# Altium schematic sheet AlcoholDetectie_V2.SchDoc
size A4; SheetNumber: 1; SheetTotal: 1
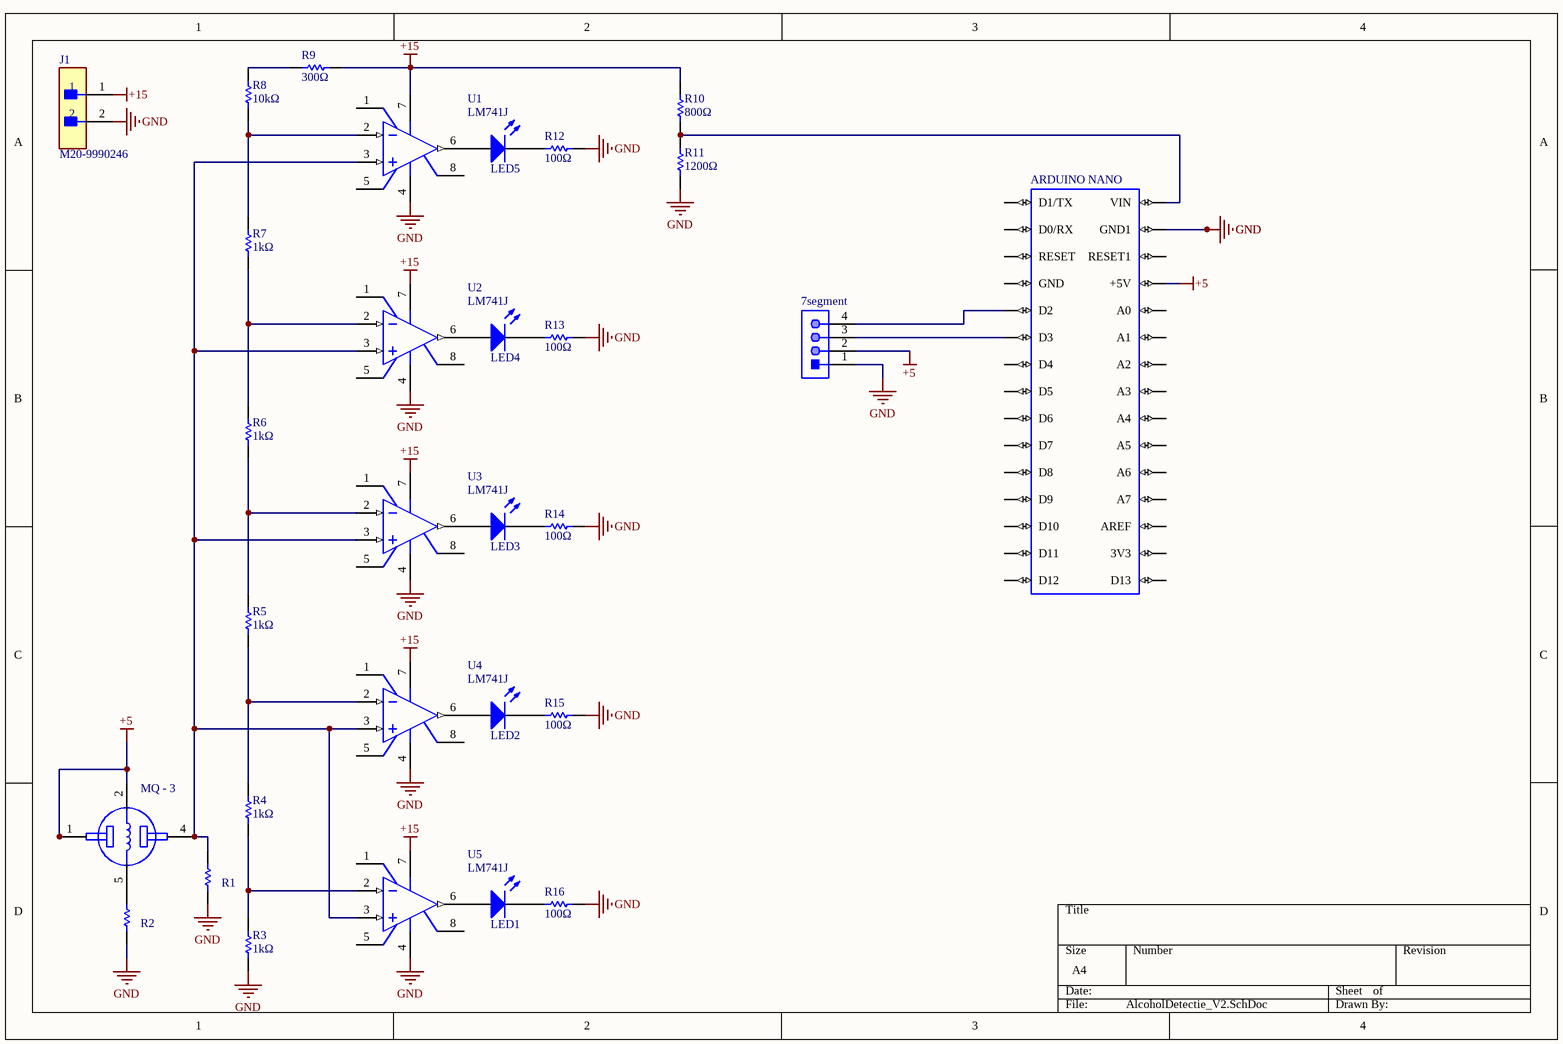
[diagram p0: AlcoholDetectie_V2.SchDoc]

## Parts
7segment  61300411121  [61300411121]  (value not drawn)
ARDUINO_NANO  ARDUINONANO  [PDIP-32]  (value not drawn)
GROEN  LED1  [LED-1]
J1  M20-9990246  [FP-M20-9990246-MFG]
MQ_-_3  SEN-08880  [XDCR_SEN-08880]  (value not drawn)
ORANJE_1  LED2  [LED-1]
ORANJE_2  LED3  [LED-1]
R1  1k Ω  [RESC2013X50X30LL20T20]  (value not drawn)
R2  5,1 Ω  [RESC2013X50X30LL20T20]  (value not drawn)
R3  1kΩ  [RESC2013X50X30LL20T20]
R4  1kΩ  [RESC2013X50X30LL20T20]
R5  1kΩ  [RESC2013X50X30LL20T20]
R6  1kΩ  [RESC2013X50X30LL20T20]
R7  1kΩ  [RESC2013X50X30LL20T20]
R8  10kΩ  [RESC2013X50X30LL20T20]
R9  300Ω  [RESC2013X50X30LL20T20]
R10  800Ω  [RESC2013X50X30LL20T20]
R11  1200Ω  [RESC2013X50X30LL20T20]
R12  100Ω  [RESC2013X50X30LL20T20]
R13  100Ω  [RESC2013X50X30LL20T20]
R14  100Ω  [RESC2013X50X30LL20T20]
R15  100Ω  [RESC2013X50X30LL20T20]
R16  100Ω  [RESC2013X50X30LL20T20]
ROOD_1  LED4  [LED-1]
ROOD_2  LED5  [LED-1]
U1  LM741J  [NAB0008A]
U2  LM741J  [NAB0008A]
U3  LM741J  [NAB0008A]
U4  LM741J  [NAB0008A]
U5  LM741J  [NAB0008A]

## Nets
+5: 7segment.2 ARDUINO_NANO.+5V MQ_-_3.1(A) MQ_-_3.2(H1) MQ_-_3.3(A)
+15: J1.1 R9.1 R10.1 U1.7(V+) U2.7(V+) U3.7(V+) U4.7(V+) U5.7(V+)
GND: 7segment.1 ARDUINO_NANO.GND1 J1.2 R1.1 R2.1 R3.1 R11.1 R12.1 R13.1 R14.1 R15.1 R16.1 U1.4(V-) U2.4(V-) U3.4(V-) U4.4(V-) U5.4(V-)
Net7segment_3: 7segment.3 ARDUINO_NANO.D3
Net7segment_4: 7segment.4 ARDUINO_NANO.D2
NetARDUINO_NANO_VIN: ARDUINO_NANO.VIN R10.2 R11.2
NetGROEN_1: GROEN.1(A) U5.6(OUT)
NetGROEN_2: GROEN.2(K) R16.2
NetMQ_-_3_4: MQ_-_3.4(B) MQ_-_3.6(B) R1.2 U1.3(IN+) U2.3(IN+) U3.3(IN+) U4.3(IN+) U5.3(IN+)
NetMQ_-_3_5: MQ_-_3.5(H2) R2.2
NetORANJE_1_1: ORANJE_1.1(A) U4.6(OUT)
NetORANJE_1_2: ORANJE_1.2(K) R15.2
NetORANJE_2_1: ORANJE_2.1(A) U3.6(OUT)
NetORANJE_2_2: ORANJE_2.2(K) R14.2
NetR3_2: R3.2 R4.1 U5.2(IN-)
NetR4_2: R4.2 R5.1 U4.2(IN-)
NetR5_2: R5.2 R6.1 U3.2(IN-)
NetR6_2: R6.2 R7.1 U2.2(IN-)
NetR7_2: R7.2 R8.1 U1.2(IN-)
NetR8_2: R8.2 R9.2
NetR12_2: R12.2 ROOD_2.2(K)
NetR13_2: R13.2 ROOD_1.2(K)
NetROOD_1_1: ROOD_1.1(A) U2.6(OUT)
NetROOD_2_1: ROOD_2.1(A) U1.6(OUT)

Not connected (* = marked no-connect by the designer): ARDUINO_NANO 3V3 A0 A1 A2 A3 A4 A5 A6 A7 AREF D0/RX D1/TX D4 D5 D6 D7 D8 D9 D10 D11 D12 D13 GND RESET RESET1; U1 1(OFS_NULL) 5(OFS_NULL) 8(NC); U2 1(OFS_NULL) 5(OFS_NULL) 8(NC); U3 1(OFS_NULL) 5(OFS_NULL) 8(NC); U4 1(OFS_NULL) 5(OFS_NULL) 8(NC); U5 1(OFS_NULL) 5(OFS_NULL) 8(NC)

## Library data of the parts
7segment = CMP-1502-01064-1: THT Vertical Pin Header WR-PHD, Pitch 2.54 mm, Single Row, 4 pins; Manufacturer: Wurth Elektronik; Withstanding Voltage: 500VAC; Rated Current: 3A; Working Voltage: 250VAC; Pin Number: 4; Gender: Male; Contact Resistance: 20mOhm; Pitch: 2.54mm; Manufacturer URL: http://www.we-online.de; Operating Temperature: -40to105degC; Packaging: Bag; Mounting Technology: THT; Package Reference: 61300411121; Datasheet URL: https://katalog.we-online.de/em/datasheet/6130xx11121.pdf; Publisher: WurthElektronik; Part Number: 61300411121; Row Number: Single; Orientation: Vertical
ARDUINO_NANO = ARDUINONANO: Arduino; 20MHz; 3.3Ã·5VDC; Flash: 32kB; SRAM: 2kB; ATMEGA328,FT232R; Package: None; MP: ARDUINONANO; MF: Arduino; SnapEDA_Link: https://www.snapeda.com/parts/ARDUINONANO/Arduino/view-part/7459719/?ref=snap; Check_prices: https://www.snapeda.com/parts/ARDUINONANO/Arduino/view-part/7459719/?ref=eda; Price: None; Value: *; Availability: Not in stock
GROEN ORANJE_1 ORANJE_2 ROOD_1 ROOD_2 = LED1: Typical RED GaAs LED; Published: 8-Jun-2000; LatestRevisionDate: 08-Jul-2005; LatestRevisionNote: Mech Layer 1 removed.; PackageReference: LED-1; Publisher: Altium Limited; PackageDescription: LED; 2 Leads
J1 = CMP-15831-000009-1: CONN HEADER VERT 2POS 2.54MM; Manufacturer: Harwin; Conn Gender: Male; Conn Orientation: Vertical; Number Of Contacts: 2; Current Rating: 3A; ComponentLink2URL: https://cdn.harwin.com/pdfs/M20-999.pdf; ComponentLink2Description: Datasheet; Package: M20-9990246; Temperature: -40°C to +105°C; Octopart: https://octopart.com/m20-9990246-harwin-2590635; Mouser Description: 2.54mm (0.1") Pitch SIL Vertical PC Tail Pin Header, 6.1mm mating pin height, tin, 2 contacts; Temperature Range High: +105°C; Device Class L1: Connectors; RoHS: TRUE; Automotive: No; Height: 8.99mm; Number Of Rows: 1; Contact Material: Tin,Nickel; Category: Conn; Pitch: 2.54mm; Lead Free: Yes; Digikey Description: CONN HEADER VERT 2POS 2.54MM; Manufacturer Part Number: M20-9990246; Temperature Range Low: -40°C; Device Class L3: unset; Device Class L2: Headers and Wire Housings
MQ_-_3 = SEN-08880: Alcohol _C2H6O_ Sensor 0 V ~ 3.3 V; MF: SparkFun Electronics; Availability: Unavailable; Package: None; Price: None; SnapEDA_Link: https://www.snapeda.com/parts/SEN-08880/SparkFun%20Electronics/view-part/1160647/?ref=snap; Value: *; MP: SEN-08880
R1-R16 = CMP-2001-04896-1: Manufacturer: Vishay Dale; Part Number: CRCW08050000Z0EA
U1-U5 = CMP-0055-00160-3: Operational Amplifier, 8-pin CerDIP; Manufacturer: Texas Instruments; PackageTopMarking: NSUZXYTT*LM741J; CompType: Amplifiers; PowerWise: N; PackageDescription: Cerdip, .400 x .310in Body, 8 Lead, .300in Centers, .100in Pitch; PinCount: 8; RoHS: N; Package Reference: NAB0008A; ComponentLink1Description: Datasheet URL; ComponentLink1URL: http://www.ti.com/general/docs/lit/getliterature.tsp?genericPartNumber=LM741&fileType=pdf